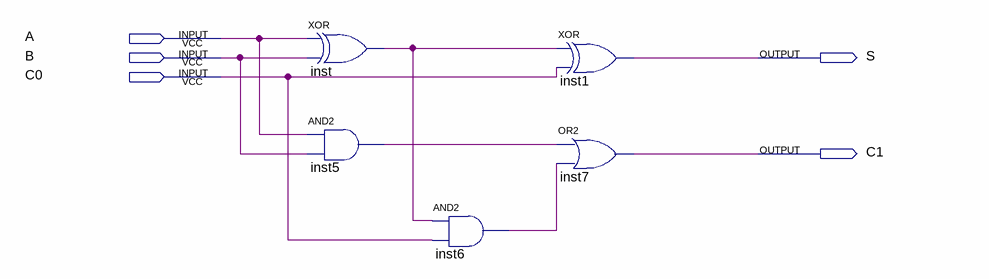
[diagram p0: schematic sheet]
// Quartus schematic MY_FADD.bdf as structural Verilog: 5 symbols, 5 pins
module MY_FADD (
  input  A,
  input  B,
  input  C0,
  output S,
  output C1
);

  wire inst5_out, inst6_out, inst_out;

  xor inst (inst_out, A, B);
  and inst5 (inst5_out, A, B);
  and inst6 (inst6_out, inst_out, C0);
  xor inst1 (S, inst_out, C0);
  or inst7 (C1, inst5_out, inst6_out);
endmodule
